# Altium schematic sheet [03] - General_Part.SchDoc
size A4
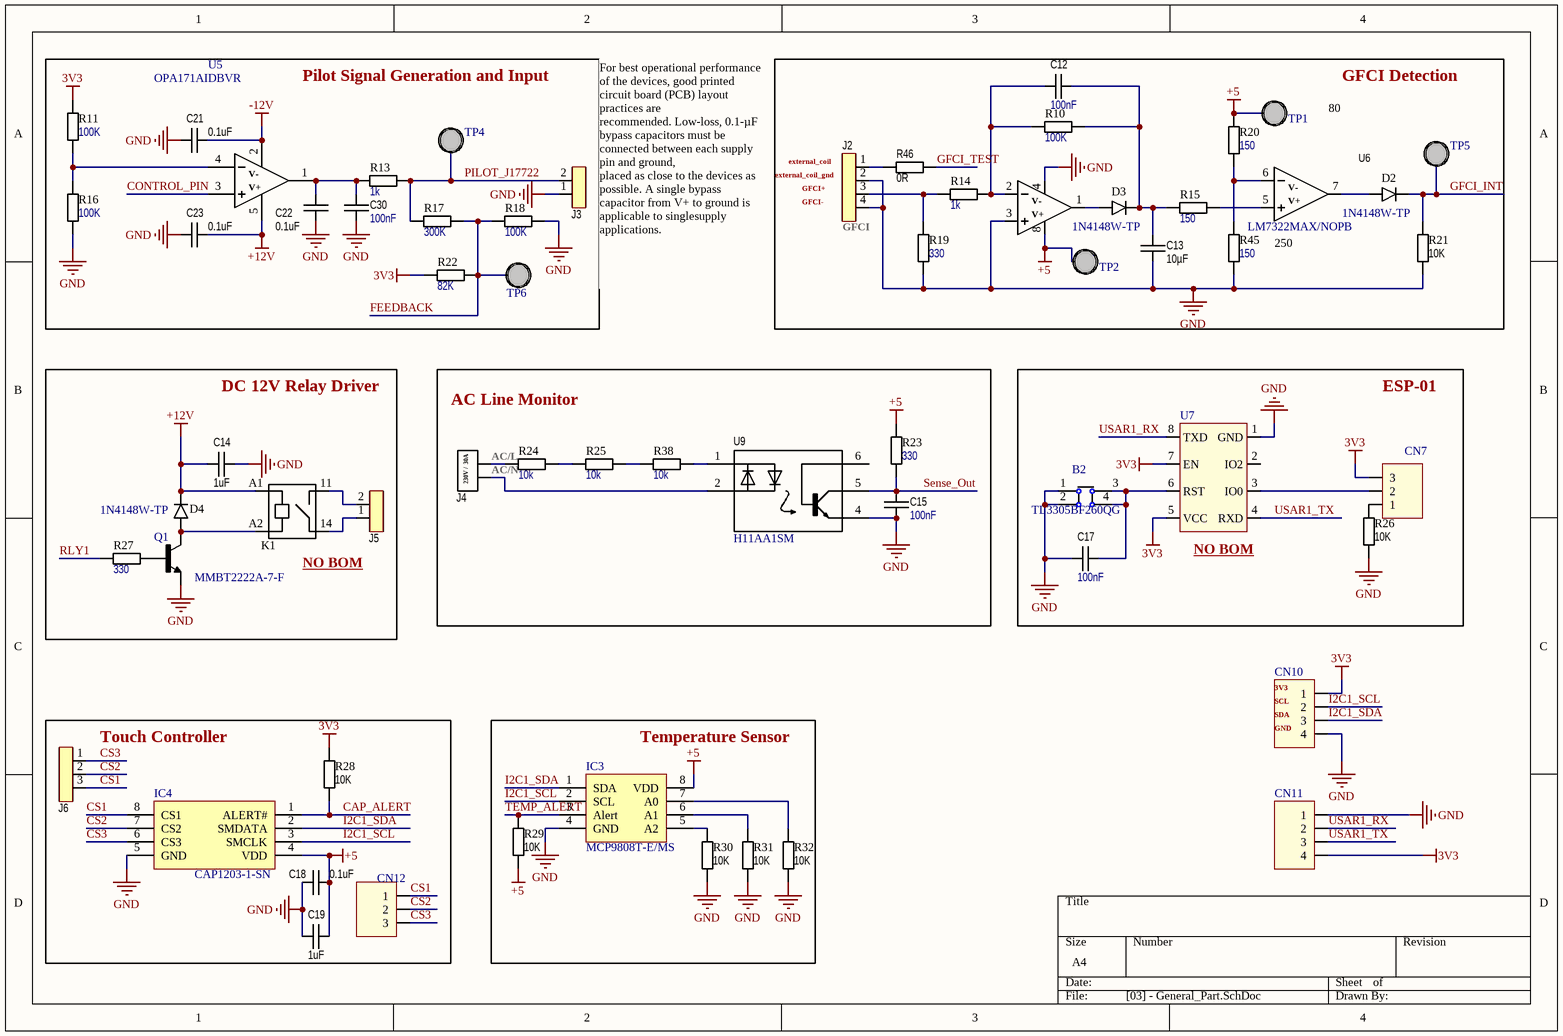
[diagram p0: [03] - General_Part.SchDoc]

## Parts
B2  TL3305BF260QG  [Switch]
C12  value 100nF  [CAP 0603/1608]  (hidden comment: CAP CER 1UF 16V X5R 0603)
C13  value 10µF  [CAP 0603/1608]  (hidden comment: GRM188R61E106MA73D)
C14  value 1uF  [CAP 0603/1608]  (hidden comment: CAP CER 1UF 25V X5R 0603)
C15  value 100nF  [CAP 0603/1608]  (hidden comment: CAP CER 1UF 16V X5R 0603)
C17  value 100nF  [CAP 0603/1608]  (hidden comment: CAP CER 1UF 16V X5R 0603)
C18  value 0.1uF  [CAP 0603/1608]  (hidden comment: C0603C104M5RACTU)
C19  value 1uF  [CAP 0603/1608]  (hidden comment: CAP CER 1UF 25V X5R 0603)
C21  value 0.1uF  [CAP 0603/1608]  (hidden comment: C0603C104M5RACTU)
C22  value 0.1uF  [CAP 0603/1608]  (hidden comment: C0603C104M5RACTU)
C23  value 0.1uF  [CAP 0603/1608]  (hidden comment: C0603C104M5RACTU)
C30  value 100nF  [CAP 0603/1608]  (hidden comment: CAP CER 1UF 16V X5R 0603)
CN7  87220-3  [Terminal_3]  (value not drawn)  (no BOM)
CN10  61300411121  [Terminal_4]  (value not drawn)  (no BOM)
CN11  61300411121  [Terminal_4]  (value not drawn)  (no BOM)
CN12  87220-3  [Terminal_3]  (value not drawn)  (no BOM)
D2  1N4148W-TP  [SOD123]
D3  1N4148W-TP  [SOD123]
D4  1N4148W-TP  [SOD123]
IC3  MCP9808T-E/MS  [MSOP-8]
IC4  CAP1203-1-SN  [SOIC-8]
J2  1985218  [BLK_04P_3.5MM]  (value not drawn)
J3  1985195  [BLK_02P_3.5MM]  (value not drawn)
J4  1868076  [30Amp_Connector]  (value not drawn)
J5  1985195  [BLK_02P_3.5MM]  (value not drawn)
J6  1995279  [BLK_03P_3.5MM]  (value not drawn)
K1  PCN-112D3MHZ,000  [Relay_PCN]  (value not drawn)  (no BOM)
Q1  MMBT2222A-7-F  [SOT23-3]
R10  value 100K  [R0603]  (hidden comment: RES SMD 100K OHM 0.1% 1/10W 0603)
R11  value 100K  [R0603]  (hidden comment: RES SMD 100K OHM 0.1% 1/10W 0603)
R13  value 1k  [R0603]  (hidden comment: RES SMD 1K OHM 5% 1/10W 0603)
R14  value 1k  [R0603]  (hidden comment: RES SMD 1K OHM 5% 1/10W 0603)
R15  value 150  [R0603]  (hidden comment: RES SMD 150 OHM 5% 1/10W 0603)
R16  value 100K  [R0603]  (hidden comment: RES SMD 100K OHM 0.1% 1/10W 0603)
R17  value 300K  [R0603]  (hidden comment: RES SMD 300K OHM 5% 1/10W 0603)
R18  value 100K  [R0603]  (hidden comment: RES SMD 100K OHM 0.1% 1/10W 0603)
R19  value 330  [R0603]  (hidden comment: RES SMD 330 OHM 1% 1/10W 060)
R20  value 150  [R0603]  (hidden comment: RES SMD 150 OHM 5% 1/10W 0603)
R21  value 10K  [R0603]  (hidden comment: ESR03EZPF1002)
R22  value 82K  [R0603]  (hidden comment: RES SMD 82K OHM 0.1% 1/10W 0603)
R23  value 330  [R0603]  (hidden comment: RES SMD 330 OHM 1% 1/10W 060)
R24  value 10k  [R1206]  (hidden comment: RES SMD 10K OHM 1% 1/4W 1206)
R25  value 10k  [R1206]  (hidden comment: RES SMD 10K OHM 1% 1/4W 1206)
R26  value 10K  [R0603]  (hidden comment: ESR03EZPF1002)
R27  value 330  [R0603]  (hidden comment: RES SMD 330 OHM 1% 1/10W 060)
R28  value 10K  [R0603]  (hidden comment: ESR03EZPF1002)
R29  value 10K  [R0603]  (hidden comment: ESR03EZPF1002)
R30  value 10K  [R0603]  (hidden comment: ESR03EZPF1002)
R31  value 10K  [R0603]  (hidden comment: ESR03EZPF1002)
R32  value 10K  [R0603]  (hidden comment: ESR03EZPF1002)
R38  value 10k  [R1206]  (hidden comment: RES SMD 10K OHM 1% 1/4W 1206)
R45  value 150  [R0603]  (hidden comment: RES SMD 150 OHM 5% 1/10W 0603)
R46  value 0R  [R0603]  (hidden comment: RES 0R 0603 JUMPER)
TP1  Test_Point  [TP]  (value not drawn)  (no BOM)
TP2  Test_Point  [TP]  (value not drawn)  (no BOM)
TP4  Test_Point  [TP]  (value not drawn)  (no BOM)
TP5  Test_Point  [TP]  (value not drawn)  (no BOM)
TP6  Test_Point  [TP]  (value not drawn)  (no BOM)
U5  OPA171AIDBVR  [SOT-23-5]
U6  LM7322MAX/NOPB  [SOIC-8]
U7  317060016  [Terminal_ESP]  (value not drawn)  (no BOM)
U9  H11AA1SM  [6-SMD]

## Blocks framed on the sheet
Pilot Signal Generation and Input: C21-C23 C30 J3 R11 R13 R16-R18 R22 TP4 TP6 U5
GFCI Detection: C12 C13 D2 D3 J2 R10 R14 R15 R19-R21 R45 R46 TP1 TP2 TP5 U6
DC 12V Relay Driver: C14 D4 J5 K1 Q1 R27
AC Line Monitor: C15 J4 R23-R25 R38 U9
ESP-01: B2 C17 CN7 R26 U7
Touch Controller: C18 C19 CN12 IC4 J6 R28
Temperature Sensor: IC3 R29-R32

## Nets
3V3: CN7.3 CN10.1 CN11.4 R11.1 R22.1 R28.1 U7.5(VCC) U7.7(EN)
+5: C18.2 C19.2 IC3.8(VDD) IC4.4(VDD) R20.1 R23.1 R29.2 TP1.1 TP2.1 U6.8(V+)
+12V: C14.1 C23.1 D4.C K1.A1 U5.5(VDD)
-12V: C21.1 U5.2(GND)
GND: B2.1 B2.2 C13.2 C14.2 C15.2 C17.1 C18.1 C19.1 C21.2 C22.2 C23.2 C30.2 CN10.4 CN11.1 IC3.4(GND) IC4.5(GND) J2.2 J2.4 J3.1 Q1.E R16.2 R18.2 R19.2 R21.2 R26.1 R30.2 R31.2 R32.2 R45.2 U6.3(INA+) U6.4(V-) U7.1(GND) U9.4(E)
CAP_ALERT: IC4.1(ALERT#) R28.2
CONTROL_PIN: U5.3(IN+)
CS1: CN12.1 IC4.8(CS1) J6.3
CS2: CN12.2 IC4.7(CS2) J6.2
CS3: CN12.3 IC4.6(CS3) J6.1
FEEDBACK: R17.2 R18.1 R22.2 TP6.1
GFCI_INT: D2.C R21.1 TP5.1
GFCI_TEST: R46.2
I2C1_SCL: CN10.2 IC3.2(SCL) IC4.3(SMCLK)
I2C1_SDA: CN10.3 IC3.1(SDA) IC4.2(SMDATA)
PILOT_J17722: J3.2 R13.2 R17.1 TP4.1
RLY1: R27.1
Sense_Out: C15.1 R23.2 U9.5(C)
TEMP_ALERT: IC3.3(Alert) R29.1
USAR1_RX: CN11.2 U7.8(TXD)
USAR1_TX: CN11.3 U7.4(RXD)
NetB2_3: B2.3 B2.4 C17.2 U7.6(RST)
NetC12_1: C12.1 R10.1 R14.2 U6.2(INA-)
NetC12_2: C12.2 C13.1 D3.C R10.2 R15.1
NetC22_1: C22.1 C30.1 R13.1 U5.1(1OUT)
NetCN7_1: CN7.1 R26.2
NetCN7_2: CN7.2 U7.3(IO0)
NetD2_A: D2.A U6.7(OUTB)
NetD3_A: D3.A U6.1(OUTA)
NetD4_A: D4.A K1.A2 Q1.C
NetIC3_5: IC3.5(A2) R30.1
NetIC3_6: IC3.6(A1) R31.1
NetIC3_7: IC3.7(A0) R32.1
NetJ2_1: J2.1 R46.1
NetJ2_3: J2.3 R14.1 R19.1
NetJ4_1: J4.1 U9.2(C/A)
NetJ4_2: J4.2 R24.1
NetJ5_1: J5.1 K1.14
NetJ5_2: J5.2 K1.11
NetQ1_B: Q1.B R27.2
NetR11_2: R11.2 R16.1 U5.4(IN-)
NetR15_2: R15.2 U6.5(INB+)
NetR20_2: R20.2 R45.1 U6.6(INB-)
NetR24_2: R24.2 R25.1
NetR25_2: R25.2 R38.1
NetR38_2: R38.2 U9.1(A/C)

Not connected (* = marked no-connect by the designer): U7 2(IO2); U9 6(B)

## Notes on the sheet
- (near J2) external_coil_gnd
- (near J2) external_coil
- 80
- (near J2) GFCI+
- (near J2) GFCI-
- (near J2) GFCI
- (near J3) For best operational performance of the devices, good printed circuit board (PCB) layout practices are
  recommended. Low-loss, 0.1-µF bypass capacitors must be connected between each supply pin and ground,
  placed as close to the devices as possible. A single bypass capacitor from V+ to ground is applicable to singlesupply applications.
- (near U6) 250
- (near R24) AC/L
- (near R24) AC/N
- (near K1) NO BOM
- (near U7) NO BOM
- (near CN10) 3V3
- (near CN10) SCL
- (near CN10) SDA
- (near CN10) GND
- (in symbol OPA171) V-; V+
- (in symbol TERM_BLK_02_30A) 230V /  30A

## Library data of the parts
B2 = SWITCH: Tactile Switch SPST-NO Top Actuated Surface Mount; Manufacturer: E-Switch; Alternative: *; PartNumber: TL3305BF260QG; Price1: 0.22000; Value: *; Price10: 0.21400; Type: TH; Price100: 0.18790; Footprint: =footprintt; Link: https://www.digikey.com/product-detail/en/e-switch/TL3305BF260QG/EG5354CT-ND/5816199
C12 C15 C17 C30 = CAPC_100NF_0603_50V: 1µF ±10% 16V Ceramic Capacitor X5R 0603 (1608 Metric) /; PartNumber: CC0603KRX5R7BB105; Manufacturer: Yageo; Type: SMD; Package: 0603 (1608 Metric); Price1: 0.11000; Price1000: 0.02217; Link: https://www.digikey.com/product-detail/en/yageo/CC0603KRX5R7BB105/311-1444-1-ND/2833750; Tolerance: ±10%; Price100: 0.03820; Voltage: 16V; Price10: 0.08100
C13 = CAPC_10uF_0603_25V: 10µF ±20% 25V Ceramic Capacitor X5R 0603 (1608 Metric); Manufacturer: Murata Electronics; Type: SMD; Package: 0603; PartNumber: GRM188R61E106MA73D; Price1: 0.42000; Price1000: 0.11123; Link: https://www.digikey.com/product-detail/en/murata-electronics/GRM188R61E106MA73D/490-7202-1-ND/3900486; Tolerance: ±20%; Price100: 0.17560; Voltage: 25V; Price10: 0.29300
C14 C19 = CAPC_1uF_0603_25V: 1µF ±20% 25V Ceramic Capacitor X5R 0603 (1608 Metric); PartNumber: TMK107BLD105MA-T; Manufacturer: Taiyo Yuden; Type: SMD; Package: 0603 (1608 Metric); Price1: 0.48000; Price1000: 0.20190; Link: https://www.digikey.com/product-detail/en/taiyo-yuden/TMK107BLD105MA-T/587-6297-1-ND/9931835; Tolerance: ±20%; Price100: 0.20190; Voltage: 25V; Price10: 0.33600
C18 C21-C23 = CAPC_0.1uF_0603_50V: 0.1µF ±20% 50V Ceramic Capacitor X7R 0603 (1608 Metric); Manufacturer: KEMET; Type: SMD; Package: 0603; PartNumber: C0603C104M5RACTU; Price1: 0.10000; Price1000: 0.00974; Link: https://www.digikey.com/product-detail/en/kemet/C0603C104M5RACTU/399-7845-1-ND/3471568; Tolerance: ±20%; Price100: 0.01740; Voltage: 50V; Price10: 0.03900
CN7 CN12 = CONN_3POS: Connector Header Through Hole 3 position 0.100" (2.54mm); Manufacturer: TE Connectivity AMP Connectors; Availablity: Available; Alternative: *; Package: 0.100" (2.54mm); Type: THT; Link: https://www.digikey.com/product-detail/en/te-connectivity-amp-connectors/87220-3/A26544-ND/298245; PartNumber: 87220-3; Footprint: =Footprint; Price1: 2.57000; Price10: 2.33000; Price100: 1.99710; Price1000: 1.42653; Value: *
CN10 CN11 = CONN_4POS: Connector Header Through Hole 4 position 0.100" (2.54mm); Manufacturer: Wurth Electronics Inc.; Availablity: Available; Alternative: *; Package: 0.100" (2.54mm); Type: THT; Link: https://www.digikey.com/product-detail/en/wurth-electronics-inc/61300411121/732-5317-ND/4846827; PartNumber: 61300411121; Footprint: =Footprint; Price1: 0.18000; Price10: 0.15300; Price100: 0.09600; Price1000: 0.08800; Value: *
D2-D4 = DIODE _100V_150MA: Diode Standard 100V 150mA Surface Mount SOD-123; Manufacturer: Micro Commercial Co; Type: SMD; Package: SOD-123; PartNumber: 1N4148W-TP; Link: https://www.digikey.com/product-detail/en/micro-commercial-co/1N4148W-TP/1N4148WTPMSCT-ND/717311; Price1: 0.10000; Price1000: 0.01854; Alternative: *; Footprint: =Footprint; Price10: 0.08100; Price100: 0.03400
IC3 = MCP9808: Temperature Sensor Digital, Local -40°C ~ 125°C 10 b 8-MSOP; Manufacturer: Microchip Technology; Alternative: *; Footprint: =Footprint; Link: https://www.digikey.com/product-detail/en/microchip-technology/MCP9808T-E-MS/MCP9808T-E-MSCT-ND/5169548; Package: 8MSOP; PartNumber: MCP9808T-E/MS; Type: SMD; Price1: 1.13000; Price10: 0.94000; Price100: 0.94000; Price1000: 0.94000; Value: *
IC4 = CAP1203: Capacitive Touch Buttons 8-SOIC; Manufacturer: Microchip Technology; Alternative: *; Footprint: =Footprint; Link: https://www.digikey.com/product-detail/en/microchip-technology/CAP1203-1-SN/CAP1203-1-SN-ND/5886098; Package: 8-SOIC; PartNumber: CAP1203-1-SN; Price1: 0.50000; Price10: 0.46000; Price100: 0.46000; Price1000: 0.46000; Type: SMD; Value: *
J2 = BLK_04_3.5: 4 Position Wire to Board Terminal Block 45° (135°) Angle with Board 0.138" (3.50mm) Through Hole; Manufacturer: Phoenix Contact; Type: TH; PartNumber: 1985218; Link: https://www.digikey.com/product-detail/en/phoenix-contact/1985218/277-1624-ND/568661; Price1: 0.58000; Price100: 0.51680; Footprint: =Footprint; Price10: 0.55500; Price1000: 0.41055
J3 J5 = BLK_02_3.5: 2 Position Wire to Board Terminal Block 45° (135°) Angle with Board 0.138" (3.50mm) Through Hole; Manufacturer: Phoenix Contact; Type: TH; PartNumber: 1985195; Link: https://www.digikey.com/product-detail/en/phoenix-contact/1985195/277-1622-ND/568659; Price1: 0.32000; Price100: 0.28090; Footprint: =Footprint; Price10: 0.30200; Price1000: 0.22313
J4 = TERM_BLK_02_30A: 2 Position Wire to Board Terminal Block Horizontal with Board 0.300" (7.62mm) Through Hole; Manufacturer: Phoenix Contact; Type: TH; PartNumber: 1868076; Link: https://www.digikey.com/product-detail/en/phoenix-contact/1868076/277-5840-ND/2511066; Price1: 1.71000; Price100: 1.42740; Footprint: =Footprint; Price10: 1.66000; Price1000: 1.17914
J6 = BLK_03_3.5: 3 Position Wire to Board Terminal Block 45° (135°) Angle with Board 0.138" (3.50mm) Through Hole; Manufacturer: Phoenix Contact; Type: TH; PartNumber: 1995279; Link: https://www.digikey.com/product-detail/en/phoenix-contact/1995279/277-14524-ND/2513974; Price1: 0.43000; Price100: 0.38200; Footprint: =Footprint; Price10: 0.41100; Price1000: 0.30350
K1 = RL_PCN: General Purpose Relay SPST-NO (1 Form A) 12VDC Coil Through Hole; Manufacturer: TE Connectivity Potter & Brumfield Relays; Type: TH; Package: Bulk; PartNumber: PCN-112D3MHZ,000; Link: https://www.digikey.com/product-detail/en/te-connectivity-potter-brumfield-relays/PCN-112D3MHZ000/PCN-112D3MHZ000-ND/1128732; Price1000: 2.19452; Footprint: =Footprint; Price10: 2.97000; Price100: 2.37600; Price1: 3.17000
Q1 = NPN_40V_0.6A: Bipolar (BJT) Transistor NPN 40V 600mA 300MHz 310mW Surface Mount SOT-23-3; Manufacturer: Diodes Incorporated; Type: SMD; Alternative: *; Package: SOT23-3; Price1000: 0.02808; PartNumber: MMBT2222A-7-F; Price1: 0.13000; Value: *; Price10: 0.12300; Price100: 0.05150; Footprint: =footprintt; Link: https://www.digikey.com/product-detail/en/diodes-incorporated/MMBT2222A-7-F/MMBT2222A-FDICT-ND/815723
R10 R11 R16 R18 = RES_100k_0603_0.1%: 100 kOhms ±0.1% 0.1W, 1/10W Chip Resistor 0603 (1608 Metric) Thin Film; PartNumber: RT0603BRD07100KL; Manufacturer: Yageo; Type: SMD; Package: 0603; Link: https://www.digikey.com/product-detail/en/yageo/RT0603BRD07100KL/YAG1235CT-ND/4340588; Price1: 0.38000; Price1000: 0.05233; Price100: 0.12500; Price10: 0.32000; Tolerance: ±0.1%
R13 R14 = RES_1k_0603_5%: 1 kOhms ±5% 0.1W, 1/10W Chip Resistor 0603 (1608 Metric) Moisture Resistant Thick Film / Do; PartNumber: RC0603JR-071KL; Manufacturer: Yageo; Type: SMD; Package: 0603; Link: https://www.digikey.com/product-detail/en/yageo/RC0603JR-071KL/311-1.0KGRCT-ND/729624; Price1: 0.10000; Price1000: 0.00347; Price100: 0.00770; Price10: 0.01900; Tolerance: ±5%
R15 R20 R45 = RES_150_0603_5%: 150 Ohms ±5% 0.1W, 1/10W Chip Resistor 0603 (1608 Metric) Moisture Resistant Thick Film; PartNumber: RC0603JR-07150RL; Manufacturer: Yageo; Type: SMD; Package: 0603; Link: https://www.digikey.com/product-detail/en/yageo/RC0603JR-07150RL/311-150GRCT-ND/729661; Price1: 0.10000; Price1000: 0.00347; Tolerance: ±5%; Price10: 0.01900; Price100: 0.00770
R17 = RES_300K_0603_1%: 300 kOhms ±5% 0.1W, 1/10W Chip Resistor 0603 (1608 Metric) Moisture Resistant Thick Film; PartNumber: RC0603JR-07300KL; Manufacturer: Yageo; Tolerance: ±1%; Type: SMD; Package: 0603; Link: https://www.digikey.com/product-detail/en/yageo/RC0603JR-07300KL/311-300KGRCT-ND/729713; Price1: 0.10000; Price1000: 0.00347; Price100: 0.00770; Price10: 0.01900
R19 R23 R27 = RES_330_0603_1%: 330 Ohms ±1% 0.1W, 1/10W Chip Resistor 0603 (1608 Metric) Moisture Resistant Thick Film; PartNumber: RC0603FR-07330RL; Manufacturer: Yageo; Type: SMD; Package: 0603; Link: https://www.digikey.com/product-detail/en/yageo/RC0603FR-07330RL/311-330HRCT-ND/730109; Price1: 0.10000; Price1000: 0.00421; Price100: 0.00940; Price10: 0.02300; Tolerance: ±1%
R21 R26 R28-R32 = RES_10K: 10 kOhms ±1% 0.25W, 1/4W Chip Resistor 0603 (1608 Metric) Automotive AEC-Q200, Pulse Withstanding Thick Film; Manufacturer: Rohm Semiconductor; Type: SMD; Package: 0603 (1608 Metric); PartNumber: ESR03EZPF1002; Link: https://www.digikey.com/product-detail/en/rohm-semiconductor/ESR03EZPF1002/RHM10KADCT-ND/1983753; Price1: 0.13000; Price1000: 0.02033; Alternative: *; Footprint: =Footprint; Price10: 0.12000; Price100: 0.04620; Availability: Available
R22 = RES_82K_0603_0.1%: 82 kOhms ±0.1% 0.1W, 1/10W Chip Resistor 0603 (1608 Metric) Thin Film; PartNumber: RT0603BRD0782KL; Manufacturer: Yageo; Tolerance: ±1%; Type: SMD; Package: 0603; Link: https://www.digikey.com/product-detail/en/yageo/RT0603BRD0782KL/YAG4597CT-ND/6616753; Price1: 0.38000; Price1000: 0.05233; Price10: 0.32000; Price100: 0.12500
R24 R25 R38 = RES_10k_1206_1%: 10 kOhms ±1% 0.25W, 1/4W Chip Resistor 1206 (3216 Metric) Automotive AEC-Q200 Thick Film; PartNumber: ERJ-8ENF1002V; Manufacturer: Panasonic Electronic Components; Type: SMD; Package: 1206 (3216 Metric); Link: digikey.com/product-detail/en/panasonic-electronic-components/ERJ-8ENF1002V/P10.0KFCT-ND/89822; Price1: 0.10000; Price1000: 0.01500; Tolerance: ±1%; Price10: 0.08900; Price100: 0.03410
R46 = RES_0R_0603_JUMPER: PartNumber: RC0603JR-070RL; Manufacturer: Yageo; Type: SMT; Package: 0603; Link: https://www.digikey.com/product-detail/en/yageo/RC0603JR-070RL/311-0.0GRTR-ND/726675; Price1: 0.1; Price1000: 0.00396; Price10: 0.022; Price100: 0.0088
U5 = OPA171: General Purpose Amplifier 1 Circuit Rail-to-Rail SOT-23-5; Manufacturer: Texas Instruments; Alternative: *; Package: OPA171 DBV Package; Price1000: 0.57680; PartNumber: OPA171AIDBVR; Price1: 1.36000; Value: *; Price10: 1.21500; Type: SMD; Price100: 0.88580; Footprint: =footprintt; Link: https://www.digikey.com/product-detail/en/texas-instruments/OPA171AIDBVR/296-37698-1-ND/4833926
U6 = OP_LM7322: General Purpose Amplifier 2 Circuit Rail-to-Rail 8-SOIC; Manufacturer: Texas Instruments; Type: SMD; Package: 8SOIC; PartNumber: LM7322MAX/NOPB; Price1: 2.58000; Price1000: 1.18193; Link: https://www.digikey.com/product-detail/en/texas-instruments/LM7322MAX-NOPB/296-35309-1-ND/3739017; Price100: 1.75100; Price10: 2.32000
U7 = ESP-01: WiFi 802.11b/g/n Transceiver Module 2.4GHz ~ 2.48GHz Integrated, Trace Through Hole; Manufacturer: Seeed Technology Co., Ltd; Availablity: Available; Alternative: *; Type: THT; Link: https://www.digikey.com/product-detail/en/seeed-technology-co-ltd/317060016/1597-1145-ND/5774757; PartNumber: 317060016; Footprint: =Footprint; Price1: 7.09000; Price10: 7.09000; Price100: 7.09000; Price1000: 7.09000; Value: *
U9 = Opto_H11AA1: Optoisolator Transistor with Base Output 4170Vrms 1 Channel 6-SMD; Manufacturer: ON Semiconductor; Type: SMD; Package: 6-SMD; PartNumber: H11AA1SM; Price1: 0.88000; Price1000: 0.29325; Link: https://www.digikey.com/product-detail/en/on-semiconductor/H11AA1SM/H11AA1SM-ND/1053619; Price100: 0.43990; Price10: 0.68400